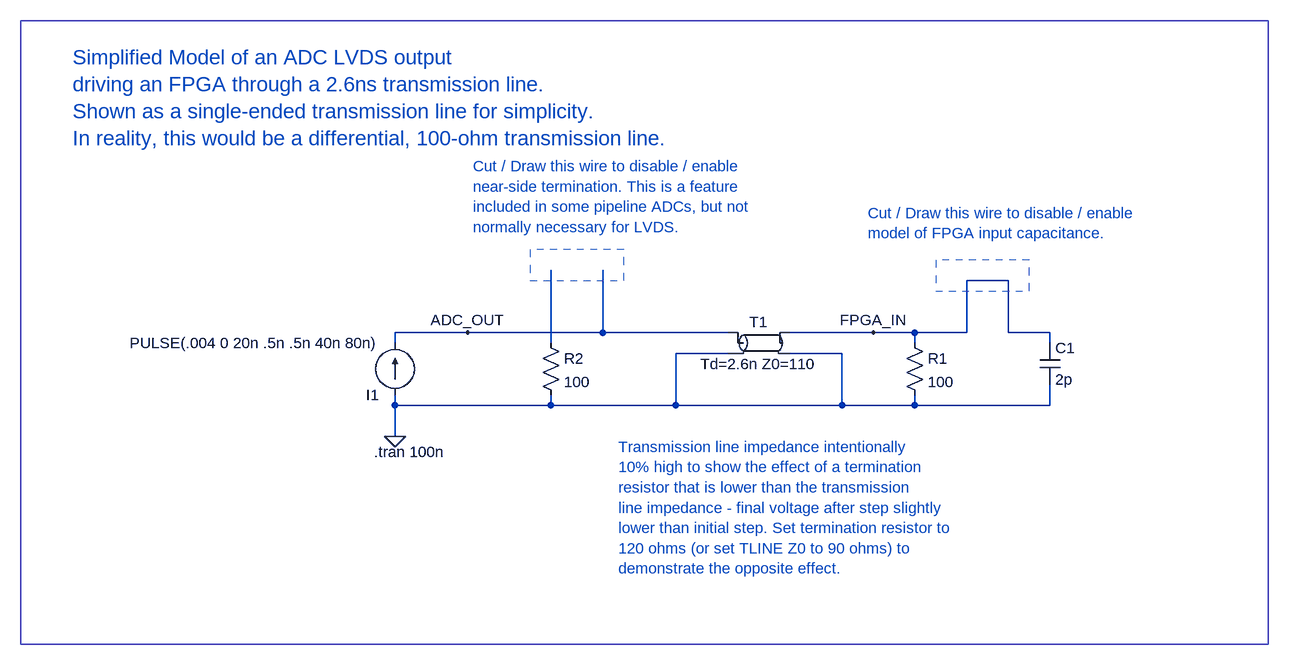
[diagram p0: schematic LVDS_FPGA_signal_integrity.asc]
LVDS_FPGA_signal_integrity.asc, the LTspice schematic file:
Version 4
SHEET 1 980 692
WIRE 576 128 512 128
WIRE -256 208 -368 208
WIRE -48 208 -48 112
WIRE -48 208 -256 208
WIRE 144 208 -48 208
WIRE 368 208 240 208
WIRE 432 208 368 208
WIRE 512 208 512 128
WIRE 512 208 432 208
WIRE 576 208 576 128
WIRE 640 208 576 208
WIRE -368 224 -368 208
WIRE -128 224 -128 112
WIRE 432 224 432 208
WIRE 640 224 640 208
WIRE 144 240 64 240
WIRE 320 240 240 240
WIRE -368 320 -368 304
WIRE -128 320 -128 304
WIRE -128 320 -368 320
WIRE 64 320 64 240
WIRE 64 320 -128 320
WIRE 320 320 320 240
WIRE 320 320 64 320
WIRE 432 320 432 304
WIRE 432 320 320 320
WIRE 640 320 640 288
WIRE 640 320 432 320
WIRE -368 368 -368 320
FLAG -368 368 0
FLAG -256 208 ADC_OUT
FLAG 368 208 FPGA_IN
SYMBOL tline 192 224 R0
SYMATTR InstName T1
SYMATTR Value Td=2.6n Z0=110
SYMBOL res 416 208 R0
SYMATTR InstName R1
SYMATTR Value 100
SYMBOL cap 624 224 R0
SYMATTR InstName C1
SYMATTR Value 2p
SYMBOL current -368 304 R180
WINDOW 123 0 0 Left 2
WINDOW 39 0 0 Left 2
SYMATTR InstName I1
SYMATTR Value PULSE(.004 0 20n .5n .5n 40n 80n)
SYMBOL res -144 208 R0
SYMATTR InstName R2
SYMATTR Value 100
TEXT -400 392 Left 2 !.tran 100n
TEXT -248 -48 Left 2 ;Cut / Draw this wire to disable / enable\nnear-side termination. This is a feature\nincluded in some pipeline ADCs, but not\nnormally necessary for LVDS.
TEXT -24 384 Left 2 ;Transmission line impedance intentionally\n10% high to show the effect of a termination\nresistor that is lower than the transmission\nline impedance - final voltage after step slightly\nlower than initial step. Set termination resistor to\n120 ohms (or set TLINE Z0 to 90 ohms) to\ndemonstrate the opposite effect.
TEXT 360 24 Left 2 ;Cut / Draw this wire to disable / enable\nmodel of FPGA input capacitance.
TEXT -864 -216 Left 3 ;Simplified Model of an ADC LVDS output\ndriving an FPGA through a 2.6ns transmission line.\nShown as a single-ended transmission line for simplicity.\nIn reality, this would be a differential, 100-ohm transmission line.
LINE Normal -160 80 -160 128 2
LINE Normal -16 80 -160 80 2
LINE Normal -16 128 -16 80 2
LINE Normal -160 128 -16 128 2
LINE Normal 464 96 464 144 2
LINE Normal 608 96 464 96 2
LINE Normal 608 144 608 96 2
LINE Normal 464 144 608 144 2
RECTANGLE Normal 976 688 -944 -272

The netlist it stands for:
* LVDS_FPGA_signal_integrity.asc
T1 ADC_OUT 0 FPGA_IN 0 Td=2.6n Z0=110
R1 FPGA_IN 0 100
C1 FPGA_IN 0 2p
I1 0 ADC_OUT PULSE(.004 0 20n .5n .5n 40n 80n)
R2 N001 0 100
.tran 100n
* Cut / Draw this wire to disable / enable
* near-side termination. This is a feature
* included in some pipeline ADCs, but not
* normally necessary for LVDS.
* Transmission line impedance intentionally
* 10% high to show the effect of a termination
* resistor that is lower than the transmission
* line impedance - final voltage after step slightly
* lower than initial step. Set termination resistor to
* 120 ohms (or set TLINE Z0 to 90 ohms) to
* demonstrate the opposite effect.
* Cut / Draw this wire to disable / enable
* model of FPGA input capacitance.
* Simplified Model of an ADC LVDS output
* driving an FPGA through a 2.6ns transmission line.
* Shown as a single-ended transmission line for simplicity.
* In reality, this would be a differential, 100-ohm transmission line.
.backanno
.end